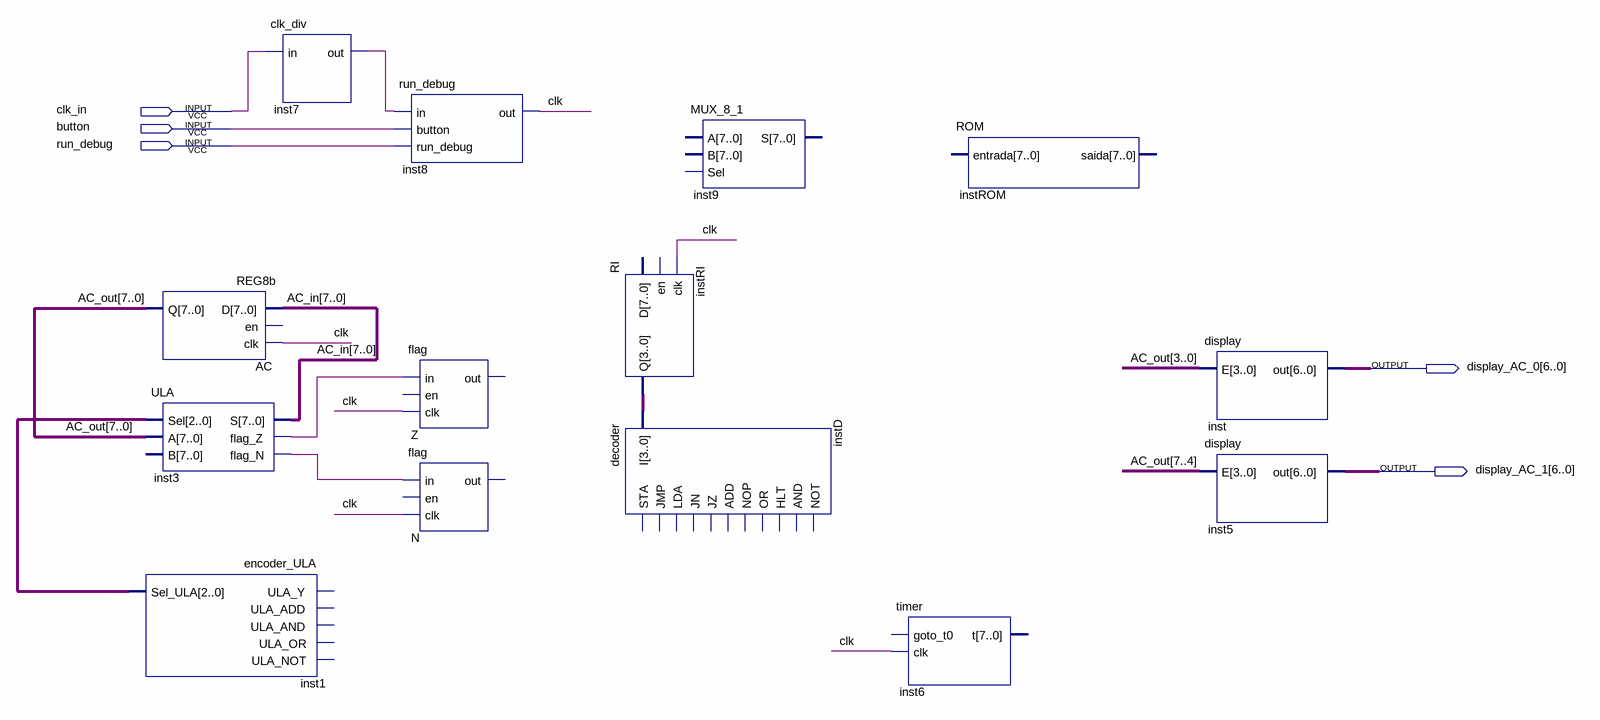
[diagram p0: schematic sheet]
// Quartus schematic NEANDER.bdf as structural Verilog: 14 symbols, 5 pins
module NEANDER (
  input  clk_in,
  input  button,
  input  run_debug,
  output [6:0] display_AC_0,
  output [6:0] display_AC_1
);

  wire clk, inst3_flag_n, inst3_flag_z, inst7_out;
  wire [2:0] inst1_sel_ula;
  wire [3:0] instRI_q;
  wire [7:0] AC_in, AC_out;

  REG8b AC (.D(AC_in), .clk(clk), .Q(AC_out));  // open: en
  ULA inst3 (.Sel(inst1_sel_ula), .A(AC_out), .S(AC_in), .flag_Z(inst3_flag_z), .flag_N(inst3_flag_n));  // open: B
  encoder_ULA inst1 (.Sel_ULA(inst1_sel_ula));  // open: ULA_Y, ULA_ADD, ULA_AND, ULA_OR, ULA_NOT
  clk_div inst7 (.in(clk_in), .out(inst7_out));
  run_debug inst8 (.in(inst7_out), .button(button), .run_debug(run_debug), .out(clk));
  flag Z (.in(inst3_flag_z), .clk(clk));  // open: en, out
  flag N (.in(inst3_flag_n), .clk(clk));  // open: en, out
  RI instRI (.clk(clk), .Q(instRI_q));  // open: D, en
  decoder instD (.I(instRI_q));  // open: STA, JMP, LDA, JN, JZ, ADD, NOP, OR, HLT, AND, NOT
  MUX_8_1 inst9 ();  // open: A, B, Sel, S
  timer inst6 (.clk(clk));  // open: goto_t0, t
  ROM instROM ();  // open: entrada, saida
  display inst (.E(AC_out[3:0]), .out(display_AC_0));
  display inst5 (.E(AC_out[7:4]), .out(display_AC_1));
endmodule
